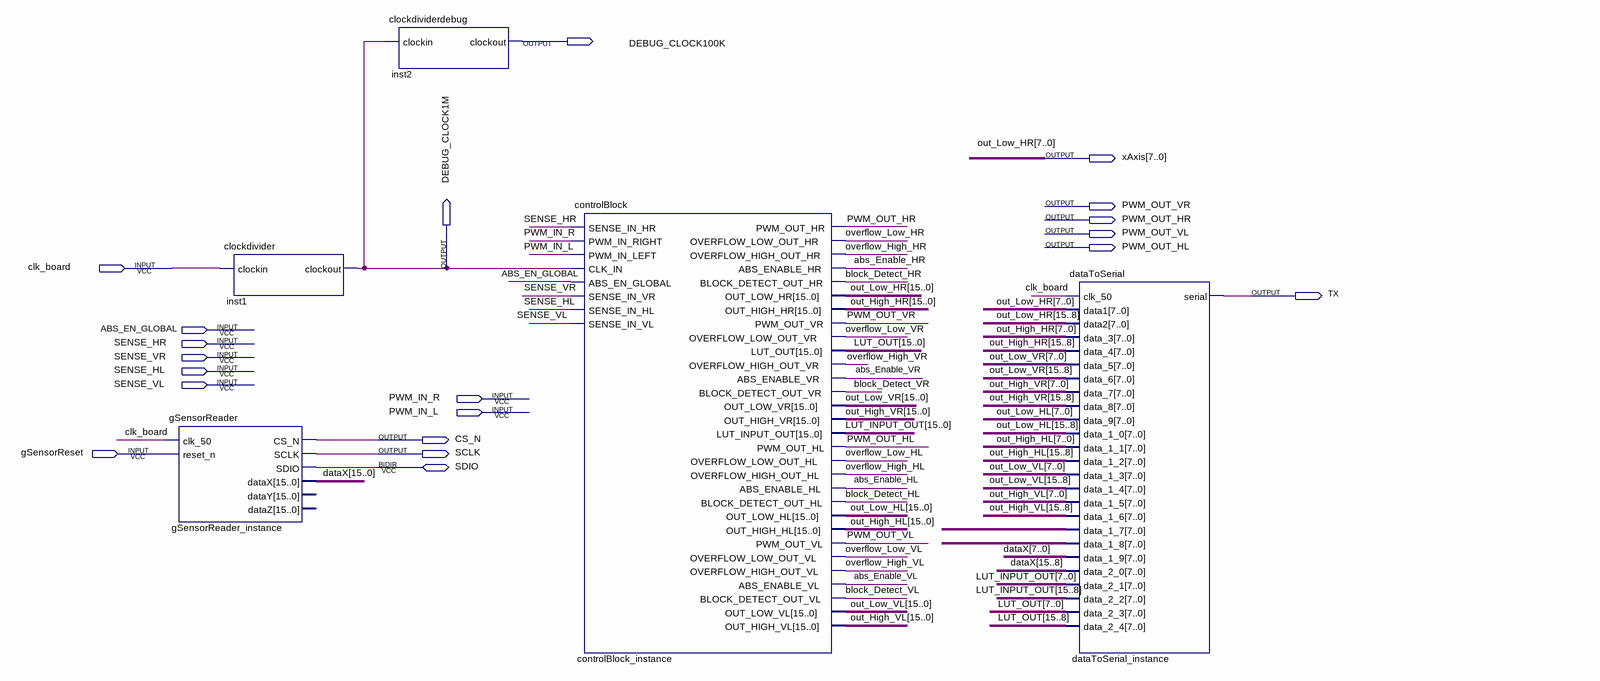
[diagram p0: schematic sheet]
// Quartus schematic absMain.bdf as structural Verilog: 5 symbols, 20 pins
module absMain (
  input  clk_board,
  input  ABS_EN_GLOBAL,
  input  SENSE_HR,
  input  SENSE_VR,
  input  SENSE_HL,
  input  SENSE_VL,
  input  PWM_IN_R,
  input  PWM_IN_L,
  input  gSensorReset,
  inout  SDIO,
  output DEBUG_CLOCK100K,
  output [7:0] xAxis,
  output PWM_OUT_VR,
  output PWM_OUT_HR,
  output PWM_OUT_VL,
  output PWM_OUT_HL,
  output DEBUG_CLOCK1M,
  output TX,
  output CS_N,
  output SCLK
);

  wire abs_Enable_HL, abs_Enable_HR, abs_Enable_VL, abs_Enable_VR, block_Detect_HL, block_Detect_HR,
       block_Detect_VL, block_Detect_VR, overflow_High_HL, overflow_High_HR, overflow_High_VL,
       overflow_High_VR, overflow_Low_HL, overflow_Low_HR, overflow_Low_VL, overflow_Low_VR;
  wire [15:0] dataX, LUT_INPUT_OUT, LUT_OUT, out_High_HL, out_High_HR, out_High_VL, out_High_VR, out_Low_HL,
       out_Low_VL, out_Low_VR;
  wire [15:8] out_Low_HR;

  gSensorReader gSensorReader_instance (
    .clk_50(clk_board), .reset_n(gSensorReset), .CS_N(CS_N), .SCLK(SCLK), .dataX(dataX), .SDIO(SDIO));  // open: dataY, dataZ
  clockdivider inst1 (.clockin(clk_board), .clockout(DEBUG_CLOCK1M));
  clockdividerdebug inst2 (.clockin(DEBUG_CLOCK1M), .clockout(DEBUG_CLOCK100K));
  controlBlock controlBlock_instance (
    .SENSE_IN_HR(SENSE_HR), .PWM_IN_RIGHT(PWM_IN_R), .PWM_IN_LEFT(PWM_IN_L), .CLK_IN(DEBUG_CLOCK1M),
    .ABS_EN_GLOBAL(ABS_EN_GLOBAL), .SENSE_IN_VR(SENSE_VR), .SENSE_IN_HL(SENSE_HL), .SENSE_IN_VL(SENSE_VL),
    .PWM_OUT_HR(PWM_OUT_HR), .OVERFLOW_LOW_OUT_HR(overflow_Low_HR), .OVERFLOW_HIGH_OUT_HR(overflow_High_HR),
    .ABS_ENABLE_HR(abs_Enable_HR), .BLOCK_DETECT_OUT_HR(block_Detect_HR), .OUT_LOW_HR({out_Low_HR, xAxis}),
    .OUT_HIGH_HR(out_High_HR), .PWM_OUT_VR(PWM_OUT_VR), .OVERFLOW_LOW_OUT_VR(overflow_Low_VR),
    .LUT_OUT(LUT_OUT), .OVERFLOW_HIGH_OUT_VR(overflow_High_VR), .ABS_ENABLE_VR(abs_Enable_VR),
    .BLOCK_DETECT_OUT_VR(block_Detect_VR), .OUT_LOW_VR(out_Low_VR), .OUT_HIGH_VR(out_High_VR),
    .LUT_INPUT_OUT(LUT_INPUT_OUT), .PWM_OUT_HL(PWM_OUT_HL), .OVERFLOW_LOW_OUT_HL(overflow_Low_HL),
    .OVERFLOW_HIGH_OUT_HL(overflow_High_HL), .ABS_ENABLE_HL(abs_Enable_HL),
    .BLOCK_DETECT_OUT_HL(block_Detect_HL), .OUT_LOW_HL(out_Low_HL), .OUT_HIGH_HL(out_High_HL),
    .PWM_OUT_VL(PWM_OUT_VL), .OVERFLOW_LOW_OUT_VL(overflow_Low_VL), .OVERFLOW_HIGH_OUT_VL(overflow_High_VL),
    .ABS_ENABLE_VL(abs_Enable_VL), .BLOCK_DETECT_OUT_VL(block_Detect_VL), .OUT_LOW_VL(out_Low_VL),
    .OUT_HIGH_VL(out_High_VL));
  dataToSerial dataToSerial_instance (
    .clk_50(clk_board), .data1(xAxis), .data2(out_Low_HR), .data_3(out_High_HR[7:0]),
    .data_4(out_High_HR[15:8]), .data_5(out_Low_VR[7:0]), .data_6(out_Low_VR[15:8]),
    .data_7(out_High_VR[7:0]), .data_8(out_High_VR[15:8]), .data_9(out_Low_HL[7:0]),
    .data_1_0(out_Low_HL[15:8]), .data_1_1(out_High_HL[7:0]), .data_1_2(out_High_HL[15:8]),
    .data_1_3(out_Low_VL[7:0]), .data_1_4(out_Low_VL[15:8]), .data_1_5(out_High_VL[7:0]),
    .data_1_6(out_High_VL[15:8]),
    .data_1_7({overflow_High_HR, overflow_Low_HR, abs_Enable_HR, block_Detect_HR, overflow_High_VR, overflow_Low_VR, abs_Enable_VR, block_Detect_VR}),
    .data_1_8({overflow_High_HL, overflow_Low_HL, abs_Enable_HL, block_Detect_HL, overflow_High_VL, overflow_Low_VL, abs_Enable_VL, block_Detect_VL}),
    .data_1_9(dataX[7:0]), .data_2_0(dataX[15:8]), .data_2_1(LUT_INPUT_OUT[7:0]),
    .data_2_2(LUT_INPUT_OUT[15:8]), .data_2_3(LUT_OUT[7:0]), .data_2_4(LUT_OUT[15:8]), .serial(TX));

  // Other names for the same wires on the sheet: out_Low_HR[7:0] = xAxis
endmodule
